# Altium project Callisto Control Board.PrjPcb
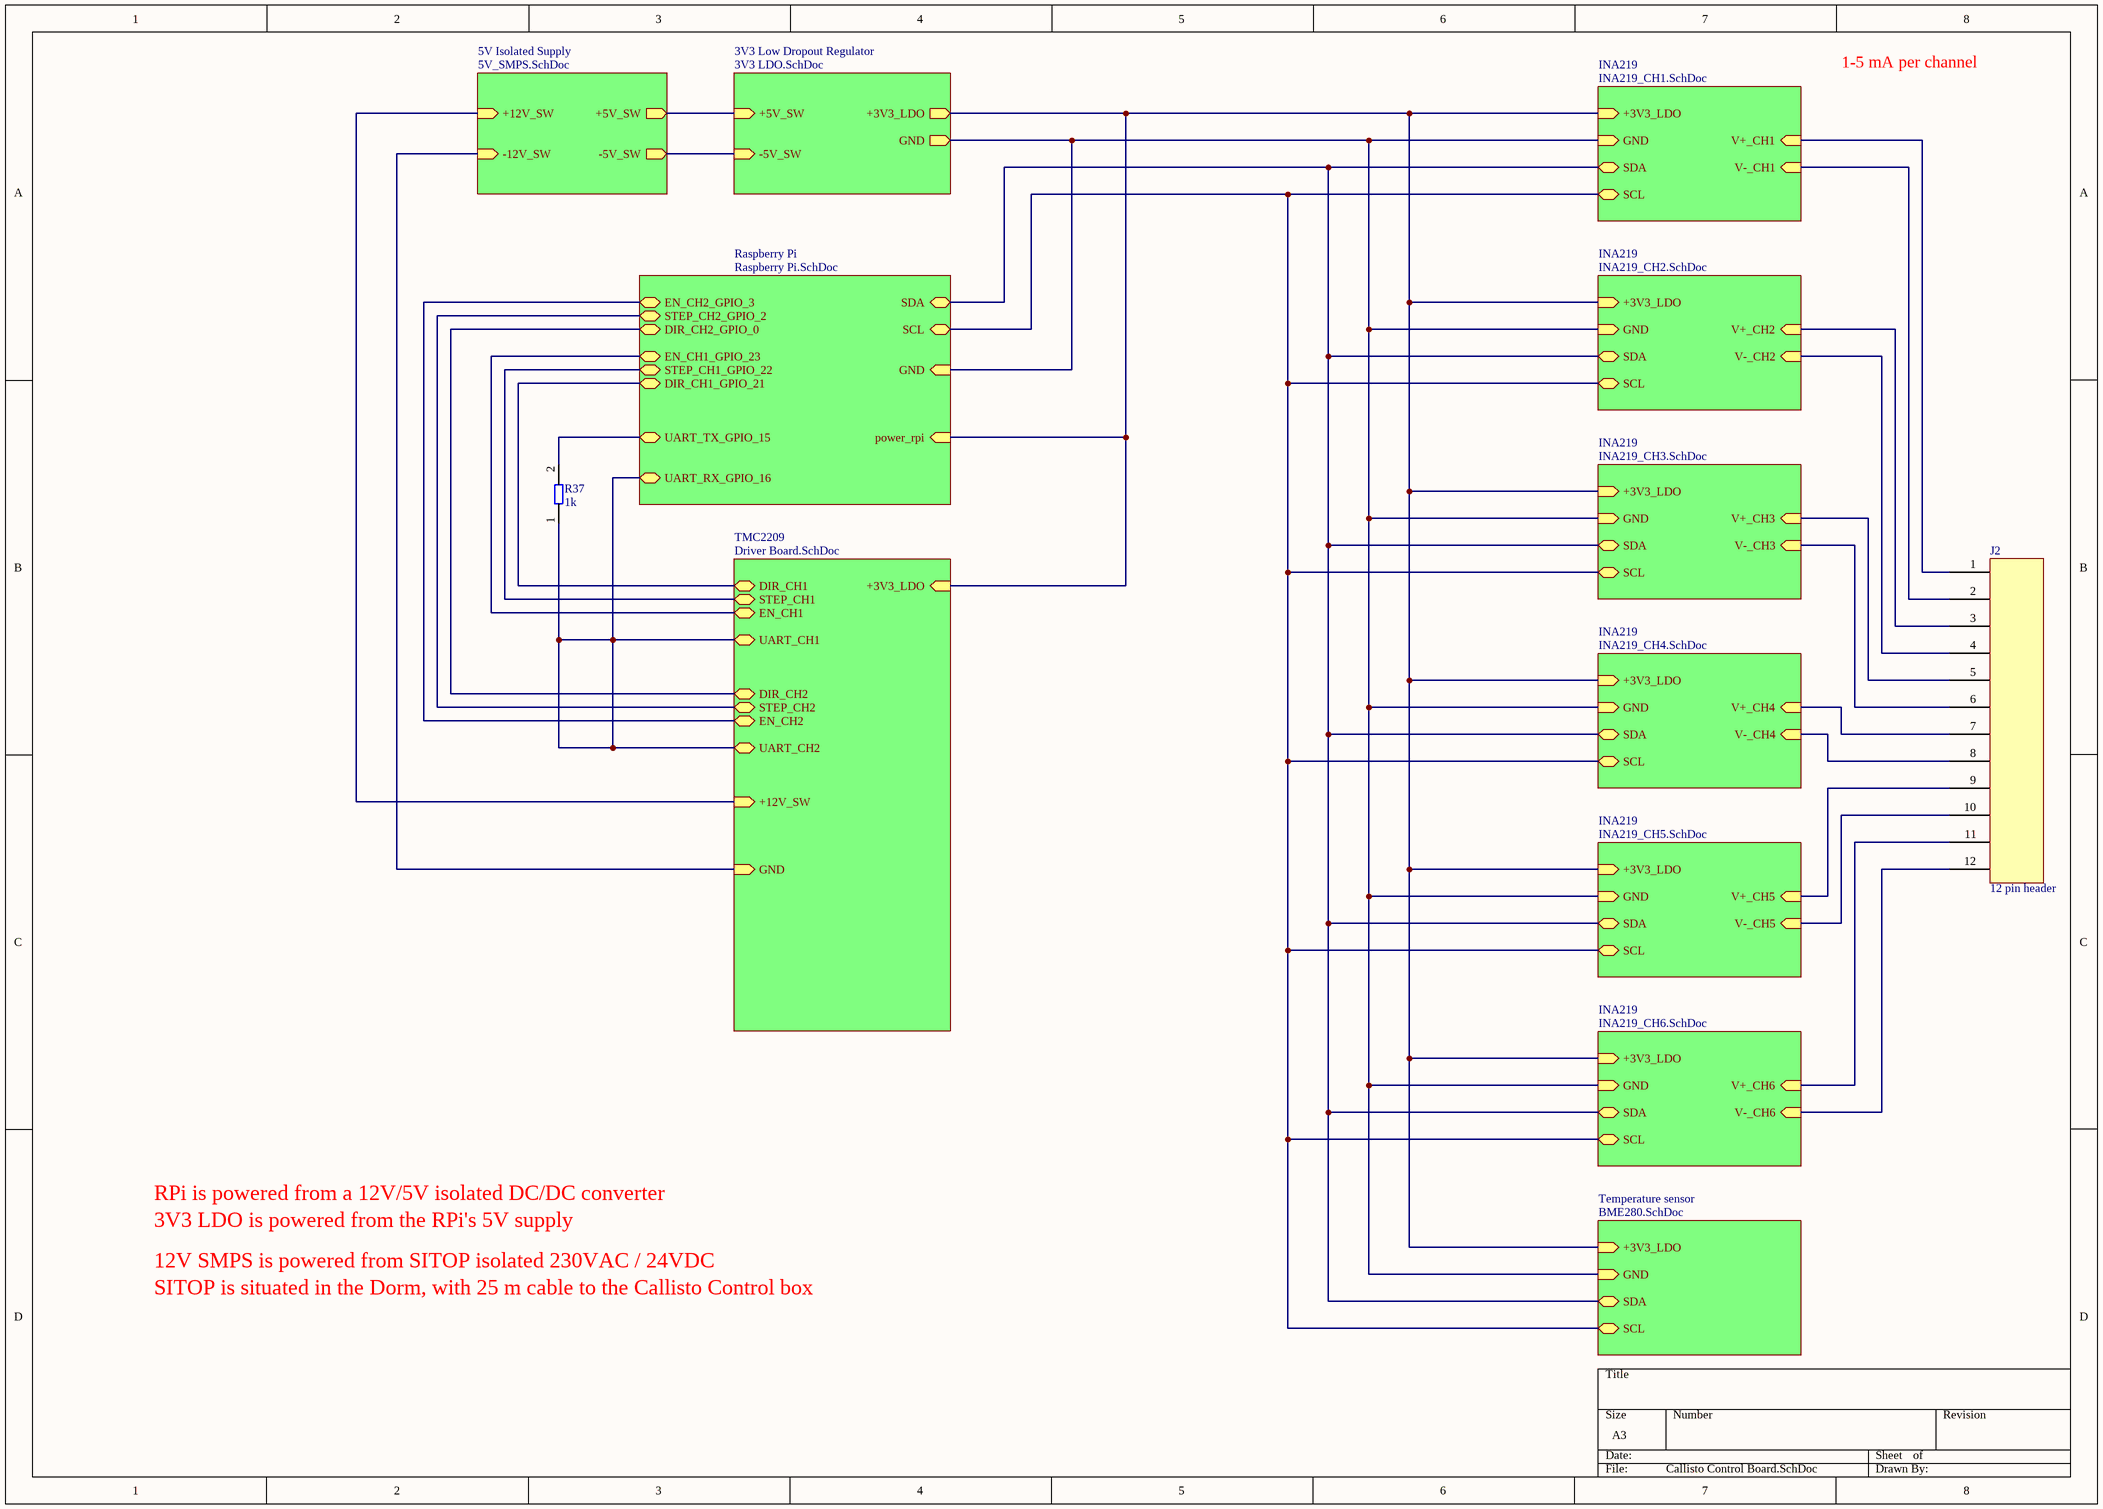
[diagram p0: Callisto Control Board.SchDoc]
11 sheets, 77 parts. Net scope: hierarchical (ports join the sheet entries above them; power ports are global).
Board file: Callisto Control Board.PcbDoc
Sheets:
  Callisto Control Board.SchDoc
    INA219 = INA219_CH1.SchDoc
    3V3 Low Dropout Regulator = 3V3 LDO.SchDoc
    INA219 = INA219_CH2.SchDoc
    INA219 = INA219_CH3.SchDoc
    INA219 = INA219_CH4.SchDoc
    INA219 = INA219_CH5.SchDoc
    INA219 = INA219_CH6.SchDoc
    Raspberry Pi = Raspberry Pi.SchDoc
    Temperature sensor = BME280.SchDoc
    TMC2209 = Driver Board.SchDoc

## Sheet Callisto Control Board.SchDoc
size A3; SheetNumber: 1; SheetTotal: 12

### Parts
(Parts that share a designator on the sheet are numbered #1, #2 ... from top to bottom, then left to right.)
J2#1  12 pin header  [12 pin terminal]
R37  1k  [0805 Resistor - IPC A]

### Sub-sheets
3V3 Low Dropout Regulator = 3V3 LDO.SchDoc: +3V3_LDO (out), GND (out), +5V_SW (in), -5V_SW (in)
5V Isolated Supply = 5V_SMPS.SchDoc (file not in this document): +12V_SW (in), -12V_SW (in), +5V_SW (out), -5V_SW (out)
INA219 = INA219_CH1.SchDoc: SDA (bidir), SCL (bidir), +3V3_LDO (in), GND (in), V+_CH1 (in), V-_CH1 (in)
INA219 = INA219_CH2.SchDoc: SDA (bidir), SCL (bidir), +3V3_LDO (in), GND (in), V+_CH2 (in), V-_CH2 (in)
INA219 = INA219_CH3.SchDoc: SDA (bidir), SCL (bidir), +3V3_LDO (in), GND (in), V+_CH3 (in), V-_CH3 (in)
INA219 = INA219_CH4.SchDoc: SDA (bidir), SCL (bidir), +3V3_LDO (in), GND (in), V+_CH4 (in), V-_CH4 (in)
INA219 = INA219_CH5.SchDoc: SDA (bidir), SCL (bidir), +3V3_LDO (in), GND (in), V+_CH5 (in), V-_CH5 (in)
INA219 = INA219_CH6.SchDoc: SDA (bidir), SCL (bidir), +3V3_LDO (in), GND (in), V+_CH6 (in), V-_CH6 (in)
Raspberry Pi = Raspberry Pi.SchDoc: SDA (bidir), SCL (bidir), GND (in), UART_TX_GPIO_15 (bidir), UART_RX_GPIO_16 (bidir), STEP_CH2_GPIO_2 (bidir), EN_CH2_GPIO_3 (bidir), DIR_CH1_GPIO_21 (bidir), STEP_CH1_GPIO_22 (bidir), EN_CH1_GPIO_23 (bidir), DIR_CH2_GPIO_0 (bidir), power_rpi (in)
Temperature sensor = BME280.SchDoc: GND (in), +3V3_LDO (in), SCL (bidir), SDA (bidir)
TMC2209 = Driver Board.SchDoc: +3V3_LDO (in), DIR_CH2 (bidir), STEP_CH2 (bidir), EN_CH2 (bidir), DIR_CH1 (bidir), STEP_CH1 (bidir), EN_CH1 (bidir), +12V_SW (in), GND (in), UART_CH2 (bidir), UART_CH1 (bidir)

### Nets
+3V3_LDO: sheet INA219/+3V3_LDO, sheet 3V3 Low Dropout Regulator/+3V3_LDO, sheet INA219/+3V3_LDO, sheet INA219/+3V3_LDO, sheet INA219/+3V3_LDO, sheet INA219/+3V3_LDO, sheet INA219/+3V3_LDO, sheet Raspberry Pi/power_rpi, sheet Temperature sensor/+3V3_LDO, sheet TMC2209/+3V3_LDO
+12V_SW: sheet TMC2209/+12V_SW, sheet 5V Isolated Supply/+12V_SW
GND: sheet INA219/GND, sheet 3V3 Low Dropout Regulator/GND, sheet 3V3 Low Dropout Regulator/-5V_SW, sheet INA219/GND, sheet INA219/GND, sheet INA219/GND, sheet INA219/GND, sheet INA219/GND, sheet Raspberry Pi/GND, sheet Temperature sensor/GND, sheet TMC2209/GND, sheet 5V Isolated Supply/-12V_SW, sheet 5V Isolated Supply/-5V_SW
GPIO_0: sheet Raspberry Pi/DIR_CH2_GPIO_0, sheet TMC2209/DIR_CH2
GPIO_2: sheet Raspberry Pi/STEP_CH2_GPIO_2, sheet TMC2209/STEP_CH2
GPIO_3: sheet Raspberry Pi/EN_CH2_GPIO_3, sheet TMC2209/EN_CH2
GPIO_21: sheet Raspberry Pi/DIR_CH1_GPIO_21, sheet TMC2209/DIR_CH1
GPIO_22: sheet Raspberry Pi/STEP_CH1_GPIO_22, sheet TMC2209/STEP_CH1
GPIO_23: sheet Raspberry Pi/EN_CH1_GPIO_23, sheet TMC2209/EN_CH1
SCL: sheet INA219/SCL, sheet INA219/SCL, sheet INA219/SCL, sheet INA219/SCL, sheet INA219/SCL, sheet INA219/SCL, sheet Raspberry Pi/SCL, sheet Temperature sensor/SCL
SDA: sheet INA219/SDA, sheet INA219/SDA, sheet INA219/SDA, sheet INA219/SDA, sheet INA219/SDA, sheet INA219/SDA, sheet Raspberry Pi/SDA, sheet Temperature sensor/SDA
NetC7_1: sheet 3V3 Low Dropout Regulator/+5V_SW, sheet 5V Isolated Supply/+5V_SW
NetJ2#1_1: J2#1.1 ; sheet INA219/V+_CH1
NetJ2#1_2: J2#1.2 ; sheet INA219/V-_CH1
NetJ2#1_3: J2#1.3 ; sheet INA219/V+_CH2
NetJ2#1_4: J2#1.4 ; sheet INA219/V-_CH2
NetJ2#1_5: J2#1.5 ; sheet INA219/V+_CH3
NetJ2#1_6: J2#1.6 ; sheet INA219/V-_CH3
NetJ2#1_7: J2#1.7 ; sheet INA219/V+_CH4
NetJ2#1_8: J2#1.8 ; sheet INA219/V-_CH4
NetJ2#1_9: J2#1.9 ; sheet INA219/V+_CH5
NetJ2#1_10: J2#1.10 ; sheet INA219/V-_CH5
NetJ2#1_11: J2#1.11 ; sheet INA219/V+_CH6
NetJ2#1_12: J2#1.12 ; sheet INA219/V-_CH6
NetR35_2: R37.2 ; sheet Raspberry Pi/UART_TX_GPIO_15
NetR36_2: R37.1 ; sheet Raspberry Pi/UART_RX_GPIO_16, sheet TMC2209/UART_CH2, sheet TMC2209/UART_CH1

### Notes on the sheet
- 1-5 mA per channel
- RPi is powered from a 12V/5V isolated DC/DC converter
- 3V3 LDO is powered from the RPi's 5V supply
- 12V SMPS is powered from SITOP isolated 230VAC / 24VDC
- SITOP is situated in the Dorm, with 25 m cable to the Callisto Control box

### Library data of the parts
J2#1 = 12 pin terminal
R37 = RC0805FR-071KL: Thick Film Resistors - SMD 1 kOhms 125 mW 0805 1% / RC0805FR-071KL; Value: 1k; Part Number: RC0805FR-071KL

## Sheet INA219_CH1.SchDoc
size A4; SheetNumber: 4; SheetTotal: 11
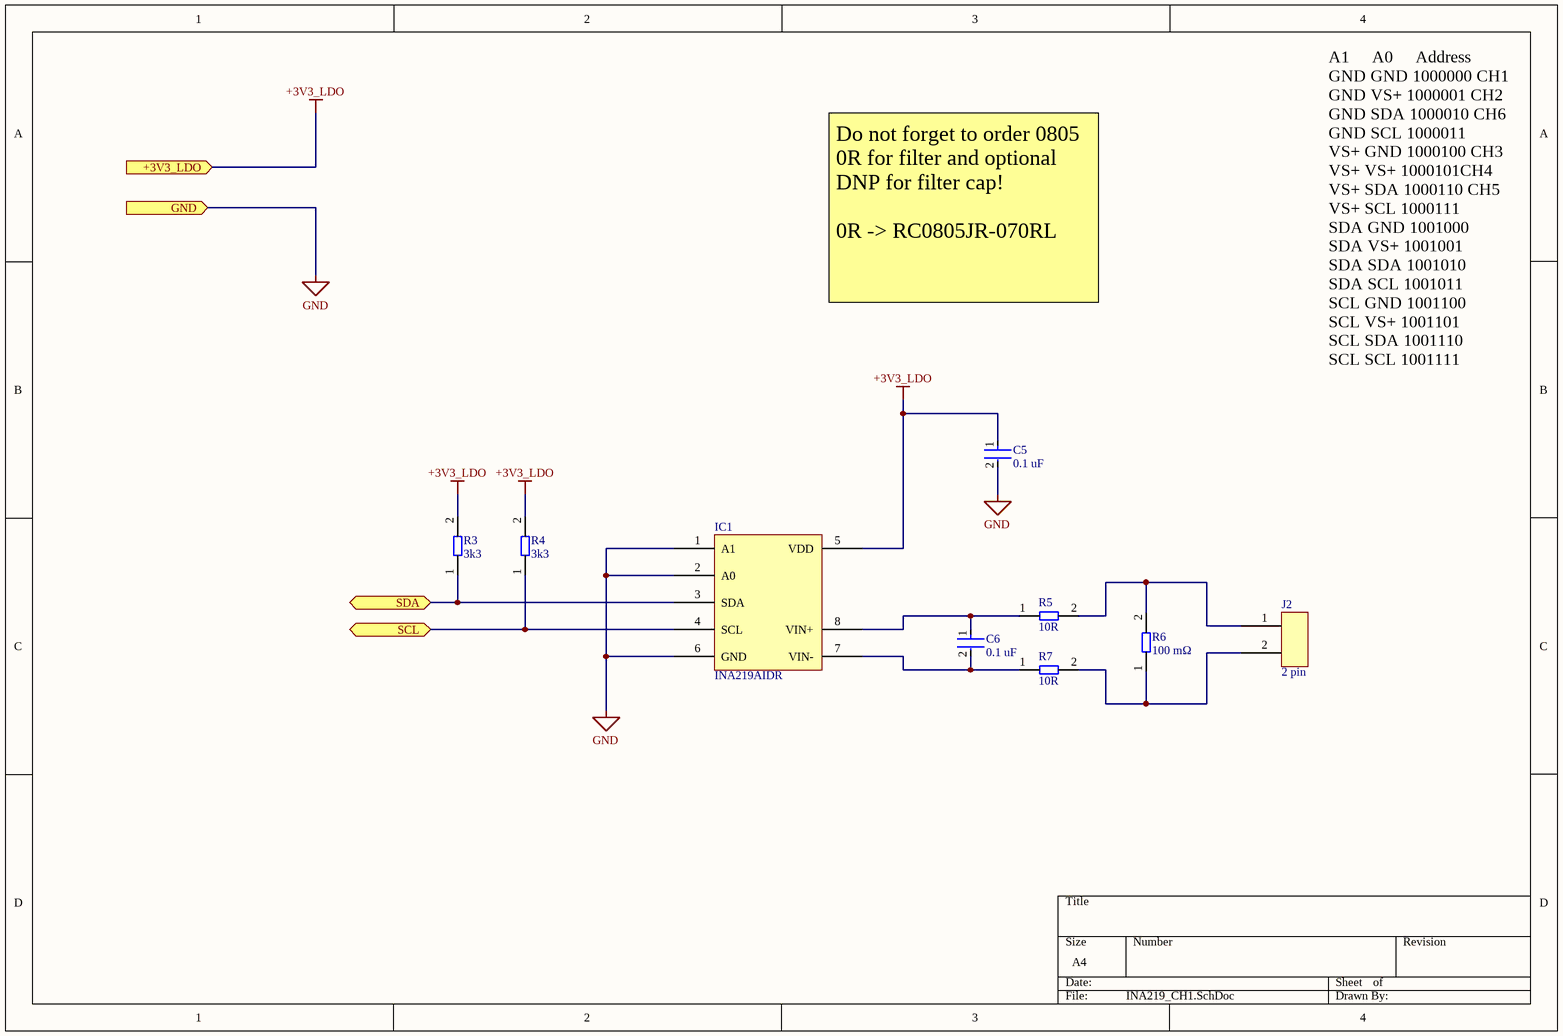
[diagram p1: INA219_CH1.SchDoc]

### Parts
(Parts that share a designator on the sheet are numbered #1, #2 ... from top to bottom, then left to right.)
C5  0.1 uF  [FP-C0805C-DN-MFG]
C6  0.1 uF  [FP-C0805C-DN-MFG]
IC1  INA219AIDR  [INA219AIDR]
J2#2  2 pin  [TB003-500-P02BE]
R3  3k3  [0805 Resistor - IPC A]
R4  3k3  [0805 Resistor - IPC A]
R5  10R  [0805 Resistor - IPC A]
R6  100 mΩ  [PE2512FKM070R1L]
R7  10R  [0805 Resistor - IPC A]

### Ports
+3V3_LDO (in, see Callisto Control Board[5A], 3V3 LDO[3B], BME280[2B], INA219_CH2[1B], INA219_CH3[1B], INA219_CH4[1B], INA219_CH5[1B], INA219_CH6[1B]), GND (in, see Callisto Control Board[5A], 3V3 LDO[3B], BME280[3B], INA219_CH2[1B], INA219_CH3[1B], INA219_CH4[1B], INA219_CH5[1B], INA219_CH6[1B], Raspberry Pi[1B]), SCL (bidir, see Callisto Control Board[6A], BME280[3B], INA219_CH2[1C], INA219_CH3[1C], INA219_CH4[1C], INA219_CH5[1C], INA219_CH6[1C], Raspberry Pi[1B]), SDA (bidir, see Callisto Control Board[6A], BME280[3B], INA219_CH2[1C], INA219_CH3[1C], INA219_CH4[1C], INA219_CH5[1C], INA219_CH6[1C], Raspberry Pi[1A])

### Nets
+3V3_LDO: C5.1 IC1.5(VDD) R3.2 R4.2 ; port +3V3_LDO
GND: C5.2 IC1.1(A1) IC1.2(A0) IC1.6(GND) ; port GND
SCL: IC1.4(SCL) R4.1 ; port SCL
SDA: IC1.3(SDA) R3.1 ; port SDA
NetC6_1: C6.1 IC1.8(VIN+) R5.1
NetC6_2: C6.2 IC1.7(VIN-) R7.1
NetJ2#2_1: J2#2.1 R5.2 R6.2
NetJ2#2_2: J2#2.2 R6.1 R7.2

### Notes on the sheet
- Do not forget to order 0805 0R for filter and optional DNP for filter cap!
  0R -> RC0805JR-070RL
- A1     A0     Address
  GND GND 1000000 CH1
  GND VS+ 1000001 CH2
  GND SDA 1000010 CH6
  GND SCL 1000011
  VS+ GND 1000100 CH3
  VS+ VS+ 1000101CH4
  VS+ SDA 1000110 CH5
  VS+ SCL 1000111
  SDA GND 1001000
  SDA VS+ 1001001
  SDA SDA 1001010
  SDA SCL 1001011
  SCL GND 1001100
  SCL VS+ 1001101
  SCL SDA 1001110
  SCL SCL 1001111

### Library data of the parts
C5 C6 = CMP-03020-002581-2: C0805 0.10 μF X7R 30ppm/°C 20.00% 50 V C0805C104M5RAC; Manufacturer: KEMET; Capacitance: 0.10 μF; Voltage Rating: 50 V; Value: 0.10 μF; Tolerance: 0.2; Material: Ceramic; Category: Cap; Temperature: -55°C to +125°C; Lead Free: Yes; Device Class L3: Ceramic Capacitors; Package: C0805C-DN; Height: 0.88mm; Temperature Range High: +125°C; Device Class L2: Capacitors; Manufacturer Part Number: C0805C104M5RAC; Device Class L1: Passive Components; Temperature Coefficient: 30ppm/°C; ComponentLink2Description: Datasheet; RoHS: TRUE; Temperature Range Low: -55°C; ComponentLink2URL: https://content.kemet.com/datasheets/KEM_C1003_C0G_SMD.pdf; Temperature Characteristic: X7R; Mouser Description: Multilayer Ceramic Capacitors MLCC - SMD/SMT 50volts 0.1uF 20% X7R; Octopart: https://octopart.com/c0805c104m5rac-kemet-2226142; Ipc Land Pattern Name: CAPC200125X78; Automotive: No
IC1 = INA219AIDR: Current & Power Monitors & Regulators Zero-Drift,Bi-Dir Crnt/Pwr Monitor
J2#2 = TB003-500-P02BE: Fixed Terminal Blocks Terminal block, screw type, 5.00 , horizontal, 2 poles, CUI Blue, Philip's head screw, PCB mount; Value: 2 pin
R3 R4 = RE0805FRE073K3L: Thick Film Resistors - SMD 3.3 kOhms 125 mW 0805 1% / RE0805FRE073K3L
R5 R7 = RC0805FR-0710RL: Thick Film Resistors - SMD 10 Ohms 125 mW 0805 1% / RC0805FR-0710RL
R6 = PE2512FKM070R1L: Current Sense Resistors - SMD 100 mOhms 1 Watt 1 % 75 ppm/C AEC-Q200 / PE2512FKM070R1L

## Sheet 3V3 LDO.SchDoc
size A4; SheetNumber: 3; SheetTotal: 11
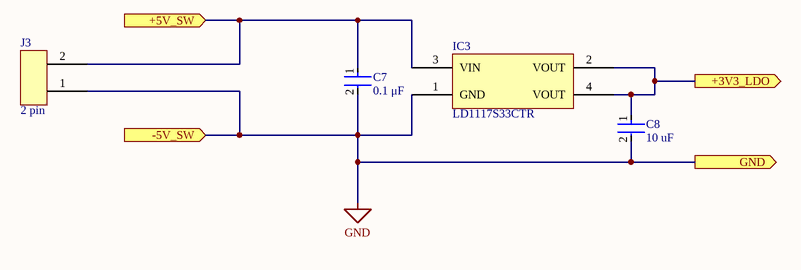
[diagram p2: 3V3 LDO.SchDoc]

### Parts
C7  0.1 μF  [FP-C0805C-DN-MFG]
C8  10 uF  [FP-C0805C-DG-MFG]
IC3  LD1117S33CTR  [LD1117]
J3  2 pin  [TB003-500-P02BE]

### Ports
+3V3_LDO (out, see Callisto Control Board[5A], BME280[2B], INA219_CH1[1A], INA219_CH2[1B], INA219_CH3[1B], INA219_CH4[1B], INA219_CH5[1B], INA219_CH6[1B]), +5V_SW (in, see Callisto Control Board[4A]), -5V_SW (in, see Callisto Control Board[4A]), GND (out, see Callisto Control Board[5A], BME280[3B], INA219_CH1[1A], INA219_CH2[1B], INA219_CH3[1B], INA219_CH4[1B], INA219_CH5[1B], INA219_CH6[1B], Raspberry Pi[1B])

### Nets
+3V3_LDO: C8.1 IC3.2(VOUT) IC3.4(VOUT) ; port +3V3_LDO
GND: C7.2 C8.2 IC3.1(GND) J3.1 ; port -5V_SW, port GND
NetC7_1: C7.1 IC3.3(VIN) J3.2 ; port +5V_SW

### Library data of the parts
C7 = CMP-03020-002581-2: C0805 0.10 μF X7R 30ppm/°C 20.00% 50 V C0805C104M5RAC; Manufacturer: KEMET; Voltage Rating: 50 V; Tolerance: 0.2; Material: Ceramic; Category: Cap; Temperature: -55°C to +125°C; Lead Free: Yes; Device Class L3: Ceramic Capacitors; Package: C0805C-DN; Capacitance: 0.1 μF; Height: 0.88mm; Temperature Range High: +125°C; Device Class L2: Capacitors; Manufacturer Part Number: C0805C104M5RAC; Device Class L1: Passive Components; Temperature Coefficient: 30ppm/°C; ComponentLink2Description: Datasheet; RoHS: TRUE; Temperature Range Low: -55°C; Value: 0.1 μF; ComponentLink2URL: https://content.kemet.com/datasheets/KEM_C1003_C0G_SMD.pdf; Temperature Characteristic: X7R; Mouser Description: Multilayer Ceramic Capacitors MLCC - SMD/SMT 50volts 0.1uF 20% X7R; Octopart: https://octopart.com/c0805c104m5rac-kemet-2226142; Ipc Land Pattern Name: CAPC200125X78; Automotive: No
C8 = CMP-2007-03243-2: CAP CER 10UF 10V X5R 0805 / C0805C106K8PACTU; Manufacturer: Kemet; 3DS Part Number: 220-00001; Tolerance: 10%; Temperature Coefficient: 15%; Material: Ceramic; Device Class L2: Capacitors; Device Class L1: Passive Components; ComponentLink2URL: https://content.kemet.com/datasheets/KEM_C1006_X5R_SMD.pdf; Height: 1.4mm; Lead Free: Yes; Manufacturer Part Number: C0805C106K8PACTU; Digikey Description: CAP CER 10UF 10V X5R 0805; Octopart: https://octopart.com/c0805c106k8pactu-kemet-98697; Capacitance: 10 uF; Value: 10 uF; Temperature Range Low: -55°C; Temperature: -55°C to +85°C; Automotive: No; Mouser Description: CAP CER 10UF 10V X5R 0805; Ipc Land Pattern Name: CAPC200125X125; Temperature Range High: +85°C; Voltage: 10V; RoHS: TRUE; Device Class L3: Ceramic Capacitors; ComponentLink2Description: Datasheet; Voltage Rating: 10V; Package: C0805C-DG; Temperature Characteristic: X5R; Category: Cap
IC3 = LD1117S33CTR: IC REG LINEAR 3.3V 800MA SOT223
J3 = TB003-500-P02BE: as J2#2 on sheet INA219_CH1; Value: 2 pin

## Sheet INA219_CH2.SchDoc
size A4; SheetNumber: 5; SheetTotal: 11
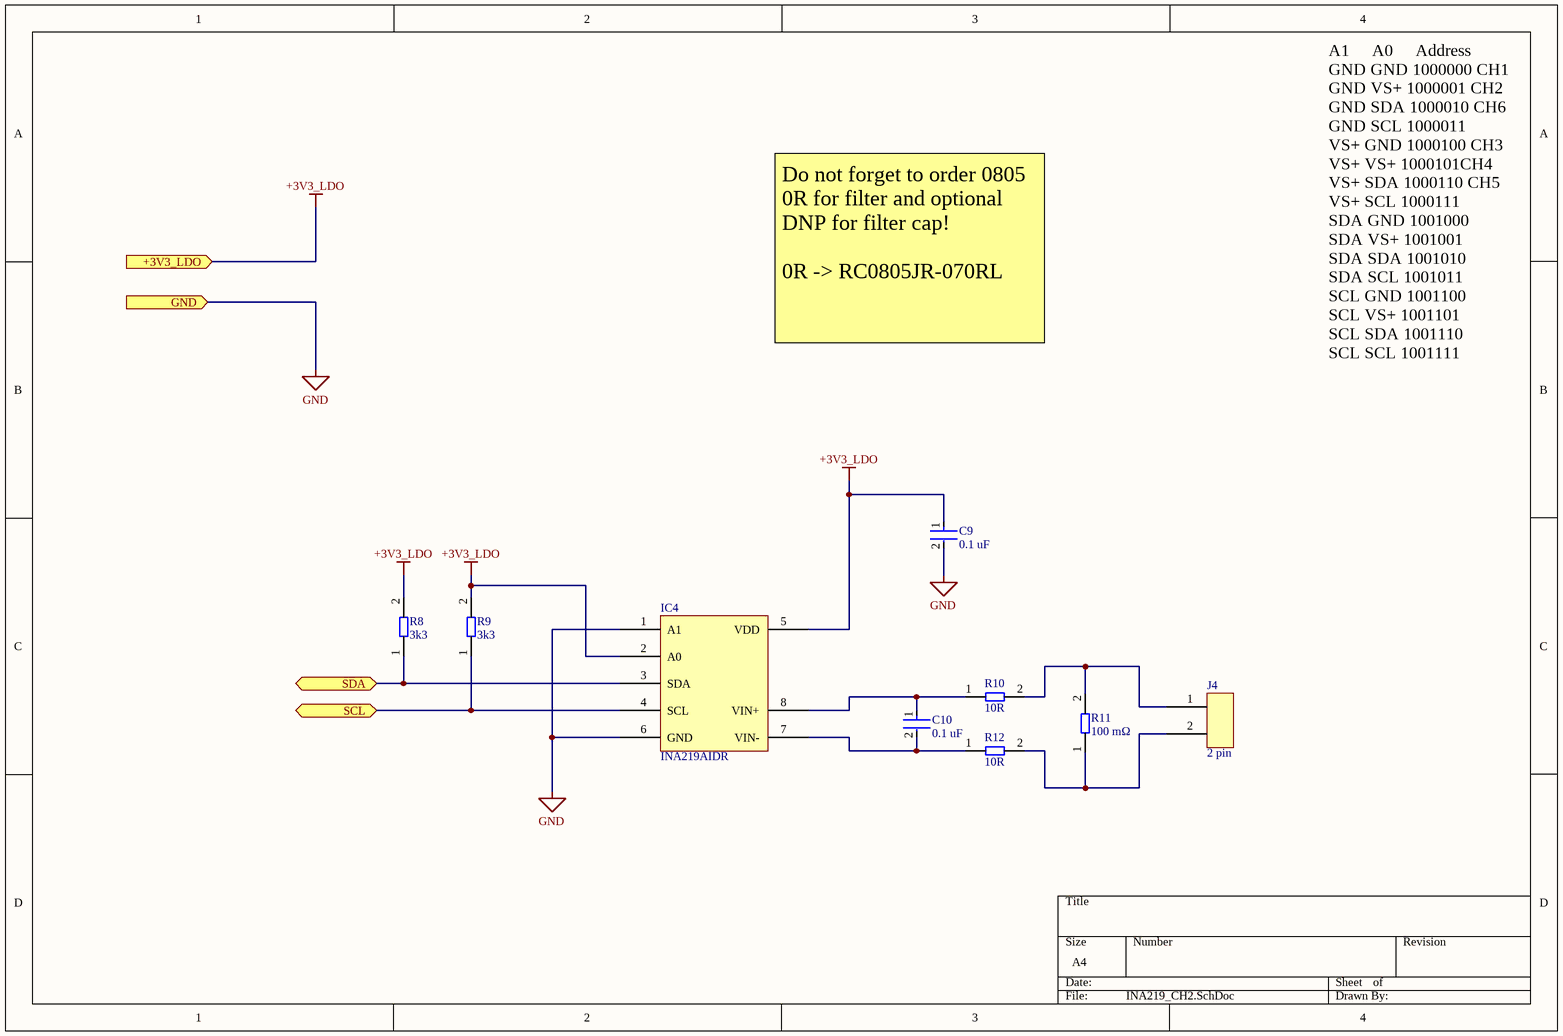
[diagram p3: INA219_CH2.SchDoc]

### Parts
(Parts that share a designator on the sheet are numbered #1, #2 ... from top to bottom, then left to right.)
C9  0.1 uF  [FP-C0805C-DN-MFG]
C10  0.1 uF  [FP-C0805C-DN-MFG]
IC4  INA219AIDR  [INA219AIDR]
J4#1  2 pin  [TB003-500-P02BE]
R8  3k3  [0805 Resistor - IPC A]
R9  3k3  [0805 Resistor - IPC A]
R10  10R  [0805 Resistor - IPC A]
R11  100 mΩ  [PE2512FKM070R1L]
R12  10R  [0805 Resistor - IPC A]

### Ports
+3V3_LDO (in, see Callisto Control Board[5B], 3V3 LDO[3B], BME280[2B], INA219_CH1[1A], INA219_CH3[1B], INA219_CH4[1B], INA219_CH5[1B], INA219_CH6[1B]), GND (in, see Callisto Control Board[5B], 3V3 LDO[3B], BME280[3B], INA219_CH1[1A], INA219_CH3[1B], INA219_CH4[1B], INA219_CH5[1B], INA219_CH6[1B], Raspberry Pi[1B]), SCL (bidir, see Callisto Control Board[6B], BME280[3B], INA219_CH1[1C], INA219_CH3[1C], INA219_CH4[1C], INA219_CH5[1C], INA219_CH6[1C], Raspberry Pi[1B]), SDA (bidir, see Callisto Control Board[6B], BME280[3B], INA219_CH1[1C], INA219_CH3[1C], INA219_CH4[1C], INA219_CH5[1C], INA219_CH6[1C], Raspberry Pi[1A])

### Nets
+3V3_LDO: C9.1 IC4.2(A0) IC4.5(VDD) R8.2 R9.2 ; port +3V3_LDO
GND: C9.2 IC4.1(A1) IC4.6(GND) ; port GND
SCL: IC4.4(SCL) R9.1 ; port SCL
SDA: IC4.3(SDA) R8.1 ; port SDA
NetC10_1: C10.1 IC4.8(VIN+) R10.1
NetC10_2: C10.2 IC4.7(VIN-) R12.1
NetJ4#1_1: J4#1.1 R10.2 R11.2
NetJ4#1_2: J4#1.2 R11.1 R12.2

### Notes on the sheet
- Do not forget to order 0805 0R for filter and optional DNP for filter cap!
  0R -> RC0805JR-070RL
- A1     A0     Address
  GND GND 1000000 CH1
  GND VS+ 1000001 CH2
  GND SDA 1000010 CH6
  GND SCL 1000011
  VS+ GND 1000100 CH3
  VS+ VS+ 1000101CH4
  VS+ SDA 1000110 CH5
  VS+ SCL 1000111
  SDA GND 1001000
  SDA VS+ 1001001
  SDA SDA 1001010
  SDA SCL 1001011
  SCL GND 1001100
  SCL VS+ 1001101
  SCL SDA 1001110
  SCL SCL 1001111

### Library data of the parts
C9 C10 = CMP-03020-002581-2: as C5 on sheet INA219_CH1; Category: Cap; Temperature: -55°C to +125°C; Lead Free: Yes; Device Class L3: Ceramic Capacitors; Package: C0805C-DN; Height: 0.88mm; Temperature Range High: +125°C; Device Class L2: Capacitors; Manufacturer Part Number: C0805C104M5RAC; Device Class L1: Passive Components; Temperature Coefficient: 30ppm/°C; ComponentLink2Description: Datasheet; RoHS: TRUE; Temperature Range Low: -55°C; ComponentLink2URL: https://content.kemet.com/datasheets/KEM_C1003_C0G_SMD.pdf; Temperature Characteristic: X7R; Mouser Description: Multilayer Ceramic Capacitors MLCC - SMD/SMT 50volts 0.1uF 20% X7R; Octopart: https://octopart.com/c0805c104m5rac-kemet-2226142; Ipc Land Pattern Name: CAPC200125X78; Automotive: No
IC4 = INA219AIDR: as IC1 on sheet INA219_CH1
J4#1 = TB003-500-P02BE: as J2#2 on sheet INA219_CH1; Value: 2 pin
R8 R9 = RE0805FRE073K3L: as R3 on sheet INA219_CH1
R10 R12 = RC0805FR-0710RL: as R5 on sheet INA219_CH1
R11 = PE2512FKM070R1L: as R6 on sheet INA219_CH1

## Sheet INA219_CH3.SchDoc
size A4; SheetNumber: 6; SheetTotal: 13
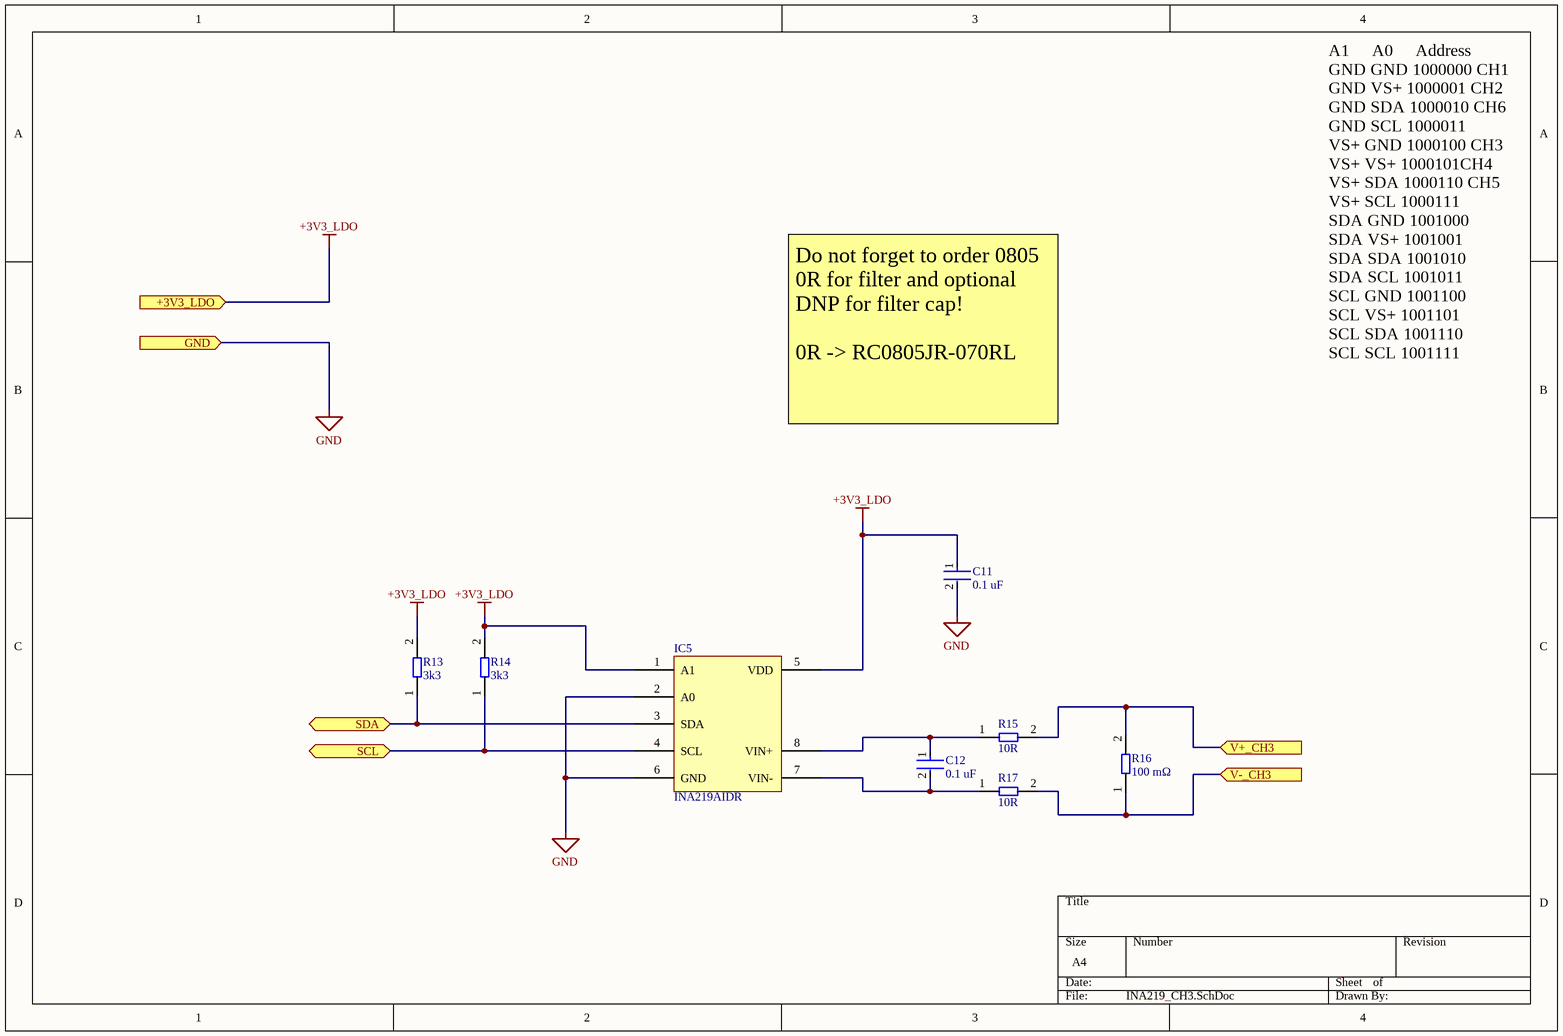
[diagram p4: INA219_CH3.SchDoc]

### Parts
C11  0.1 uF  [FP-C0805C-DN-MFG]
C12  0.1 uF  [FP-C0805C-DN-MFG]
IC5  INA219AIDR  [INA219AIDR]
R13  3k3  [0805 Resistor - IPC A]
R14  3k3  [0805 Resistor - IPC A]
R15  10R  [0805 Resistor - IPC A]
R16  100 mΩ  [PE2512FKM070R1L]
R17  10R  [0805 Resistor - IPC A]

### Ports
+3V3_LDO (in, see Callisto Control Board[7B], 3V3 LDO[3B], BME280[2B], Driver Board[1B], INA219_CH1[1A], INA219_CH2[1B], INA219_CH4[1B], INA219_CH5[1B], INA219_CH6[1B]), GND (in, see Callisto Control Board[7B], 3V3 LDO[3B], BME280[3B], Driver Board[1B], INA219_CH1[1A], INA219_CH2[1B], INA219_CH4[1B], INA219_CH5[1B], INA219_CH6[1B], Raspberry Pi[1C]), SCL (bidir, see Callisto Control Board[7B], BME280[3B], INA219_CH1[1C], INA219_CH2[1C], INA219_CH4[1C], INA219_CH5[1C], INA219_CH6[1C], Raspberry Pi[1B]), SDA (bidir, see Callisto Control Board[7B], BME280[3B], INA219_CH1[1C], INA219_CH2[1C], INA219_CH4[1C], INA219_CH5[1C], INA219_CH6[1C], Raspberry Pi[1A]), V+_CH3 (in), V-_CH3 (in)

### Nets
+3V3_LDO: C11.1 IC5.1(A1) IC5.5(VDD) R13.2 R14.2 ; port +3V3_LDO
GND: C11.2 IC5.2(A0) IC5.6(GND) ; port GND
SCL: IC5.4(SCL) R14.1 ; port SCL
SDA: IC5.3(SDA) R13.1 ; port SDA
NetC12_1: C12.1 IC5.8(VIN+) R15.1
NetC12_2: C12.2 IC5.7(VIN-) R17.1
NetJ2#1_5: R15.2 R16.2 ; port V+_CH3
NetJ2#1_6: R16.1 R17.2 ; port V-_CH3

### Notes on the sheet
- A1     A0     Address
  GND GND 1000000 CH1
  GND VS+ 1000001 CH2
  GND SDA 1000010 CH6
  GND SCL 1000011
  VS+ GND 1000100 CH3
  VS+ VS+ 1000101CH4
  VS+ SDA 1000110 CH5
  VS+ SCL 1000111
  SDA GND 1001000
  SDA VS+ 1001001
  SDA SDA 1001010
  SDA SCL 1001011
  SCL GND 1001100
  SCL VS+ 1001101
  SCL SDA 1001110
  SCL SCL 1001111
- Do not forget to order 0805 0R for filter and optional DNP for filter cap!
  0R -> RC0805JR-070RL

### Library data of the parts
C11 C12 = CMP-03020-002581-2: as C5 on sheet INA219_CH1; Category: Cap; Temperature: -55°C to +125°C; Lead Free: Yes; Device Class L3: Ceramic Capacitors; Package: C0805C-DN; Height: 0.88mm; Temperature Range High: +125°C; Device Class L2: Capacitors; Manufacturer Part Number: C0805C104M5RAC; Device Class L1: Passive Components; Temperature Coefficient: 30ppm/°C; ComponentLink2Description: Datasheet; RoHS: TRUE; Temperature Range Low: -55°C; ComponentLink2URL: https://content.kemet.com/datasheets/KEM_C1003_C0G_SMD.pdf; Temperature Characteristic: X7R; Mouser Description: Multilayer Ceramic Capacitors MLCC - SMD/SMT 50volts 0.1uF 20% X7R; Octopart: https://octopart.com/c0805c104m5rac-kemet-2226142; Ipc Land Pattern Name: CAPC200125X78; Automotive: No
IC5 = INA219AIDR: as IC1 on sheet INA219_CH1
R13 R14 = RE0805FRE073K3L: as R3 on sheet INA219_CH1
R15 R17 = RC0805FR-0710RL: as R5 on sheet INA219_CH1
R16 = PE2512FKM070R1L: as R6 on sheet INA219_CH1

## Sheet INA219_CH4.SchDoc
size A4; SheetNumber: 7; SheetTotal: 13
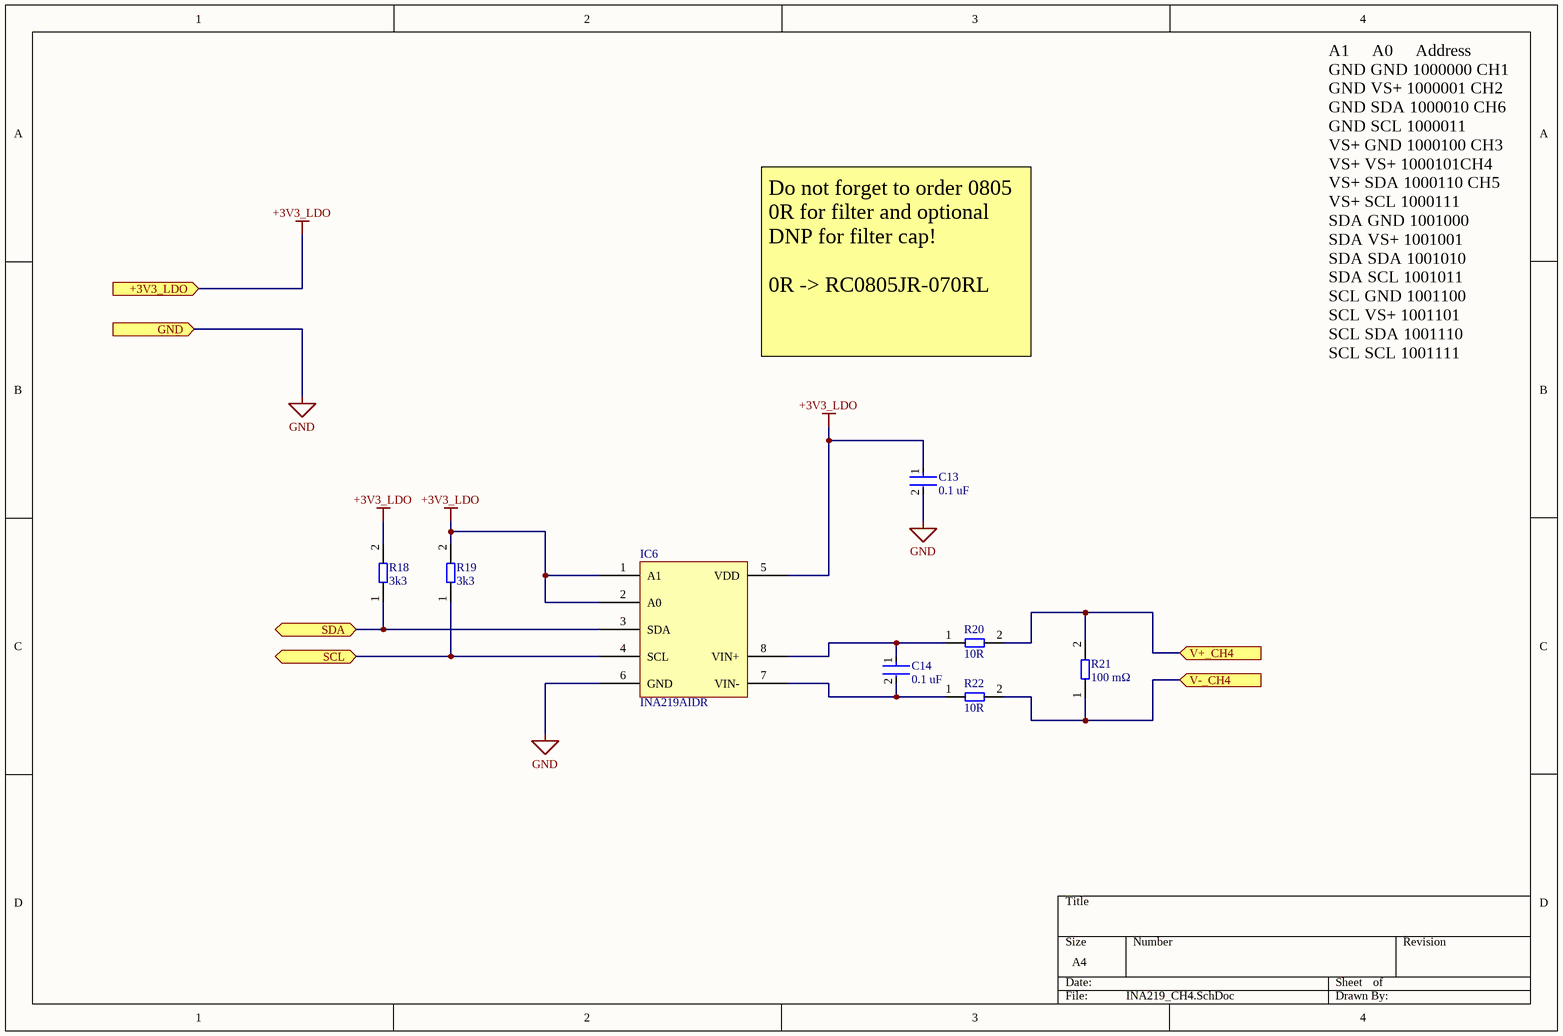
[diagram p5: INA219_CH4.SchDoc]

### Parts
C13  0.1 uF  [FP-C0805C-DN-MFG]
C14  0.1 uF  [FP-C0805C-DN-MFG]
IC6  INA219AIDR  [INA219AIDR]
R18  3k3  [0805 Resistor - IPC A]
R19  3k3  [0805 Resistor - IPC A]
R20  10R  [0805 Resistor - IPC A]
R21  100 mΩ  [PE2512FKM070R1L]
R22  10R  [0805 Resistor - IPC A]

### Ports
+3V3_LDO (in, see Callisto Control Board[7B], 3V3 LDO[3B], BME280[2B], Driver Board[1B], INA219_CH1[1A], INA219_CH2[1B], INA219_CH3[1B], INA219_CH5[1B], INA219_CH6[1B]), GND (in, see Callisto Control Board[7B], 3V3 LDO[3B], BME280[3B], Driver Board[1B], INA219_CH1[1A], INA219_CH2[1B], INA219_CH3[1B], INA219_CH5[1B], INA219_CH6[1B], Raspberry Pi[1C]), SCL (bidir, see Callisto Control Board[7C], BME280[3B], INA219_CH1[1C], INA219_CH2[1C], INA219_CH3[1C], INA219_CH5[1C], INA219_CH6[1C], Raspberry Pi[1B]), SDA (bidir, see Callisto Control Board[7B], BME280[3B], INA219_CH1[1C], INA219_CH2[1C], INA219_CH3[1C], INA219_CH5[1C], INA219_CH6[1C], Raspberry Pi[1A]), V+_CH4 (in), V-_CH4 (in)

### Nets
+3V3_LDO: C13.1 IC6.1(A1) IC6.2(A0) IC6.5(VDD) R18.2 R19.2 ; port +3V3_LDO
GND: C13.2 IC6.6(GND) ; port GND
SCL: IC6.4(SCL) R19.1 ; port SCL
SDA: IC6.3(SDA) R18.1 ; port SDA
NetC14_1: C14.1 IC6.8(VIN+) R20.1
NetC14_2: C14.2 IC6.7(VIN-) R22.1
NetJ2#1_7: R20.2 R21.2 ; port V+_CH4
NetJ2#1_8: R21.1 R22.2 ; port V-_CH4

### Notes on the sheet
- Do not forget to order 0805 0R for filter and optional DNP for filter cap!
  0R -> RC0805JR-070RL
- A1     A0     Address
  GND GND 1000000 CH1
  GND VS+ 1000001 CH2
  GND SDA 1000010 CH6
  GND SCL 1000011
  VS+ GND 1000100 CH3
  VS+ VS+ 1000101CH4
  VS+ SDA 1000110 CH5
  VS+ SCL 1000111
  SDA GND 1001000
  SDA VS+ 1001001
  SDA SDA 1001010
  SDA SCL 1001011
  SCL GND 1001100
  SCL VS+ 1001101
  SCL SDA 1001110
  SCL SCL 1001111

### Library data of the parts
C13 C14 = CMP-03020-002581-2: as C5 on sheet INA219_CH1; Category: Cap; Temperature: -55°C to +125°C; Lead Free: Yes; Device Class L3: Ceramic Capacitors; Package: C0805C-DN; Height: 0.88mm; Temperature Range High: +125°C; Device Class L2: Capacitors; Manufacturer Part Number: C0805C104M5RAC; Device Class L1: Passive Components; Temperature Coefficient: 30ppm/°C; ComponentLink2Description: Datasheet; RoHS: TRUE; Temperature Range Low: -55°C; ComponentLink2URL: https://content.kemet.com/datasheets/KEM_C1003_C0G_SMD.pdf; Temperature Characteristic: X7R; Mouser Description: Multilayer Ceramic Capacitors MLCC - SMD/SMT 50volts 0.1uF 20% X7R; Octopart: https://octopart.com/c0805c104m5rac-kemet-2226142; Ipc Land Pattern Name: CAPC200125X78; Automotive: No
IC6 = INA219AIDR: as IC1 on sheet INA219_CH1
R18 R19 = RE0805FRE073K3L: as R3 on sheet INA219_CH1
R20 R22 = RC0805FR-0710RL: as R5 on sheet INA219_CH1
R21 = PE2512FKM070R1L: as R6 on sheet INA219_CH1

## Sheet INA219_CH5.SchDoc
size A4; SheetNumber: 8; SheetTotal: 13
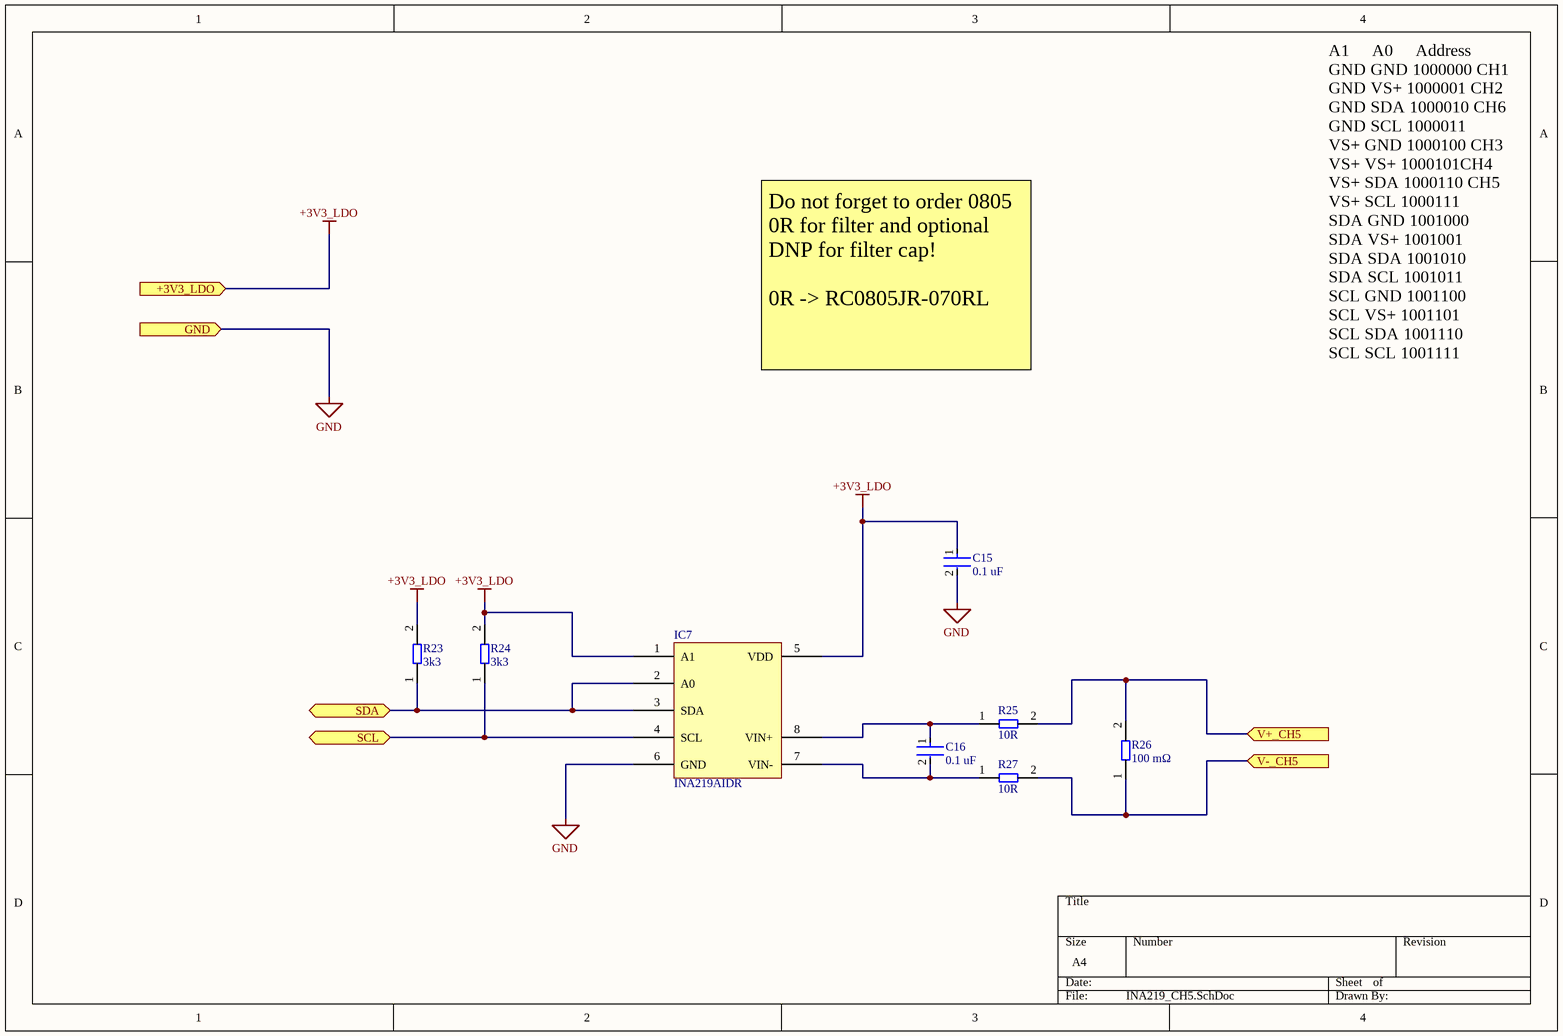
[diagram p6: INA219_CH5.SchDoc]

### Parts
C15  0.1 uF  [FP-C0805C-DN-MFG]
C16  0.1 uF  [FP-C0805C-DN-MFG]
IC7  INA219AIDR  [INA219AIDR]
R23  3k3  [0805 Resistor - IPC A]
R24  3k3  [0805 Resistor - IPC A]
R25  10R  [0805 Resistor - IPC A]
R26  100 mΩ  [PE2512FKM070R1L]
R27  10R  [0805 Resistor - IPC A]

### Ports
+3V3_LDO (in, see Callisto Control Board[7C], 3V3 LDO[3B], BME280[2B], Driver Board[1B], INA219_CH1[1A], INA219_CH2[1B], INA219_CH3[1B], INA219_CH4[1B], INA219_CH6[1B]), GND (in, see Callisto Control Board[7C], 3V3 LDO[3B], BME280[3B], Driver Board[1B], INA219_CH1[1A], INA219_CH2[1B], INA219_CH3[1B], INA219_CH4[1B], INA219_CH6[1B], Raspberry Pi[1C]), SCL (bidir, see Callisto Control Board[7C], BME280[3B], INA219_CH1[1C], INA219_CH2[1C], INA219_CH3[1C], INA219_CH4[1C], INA219_CH6[1C], Raspberry Pi[1B]), SDA (bidir, see Callisto Control Board[7C], BME280[3B], INA219_CH1[1C], INA219_CH2[1C], INA219_CH3[1C], INA219_CH4[1C], INA219_CH6[1C], Raspberry Pi[1A]), V+_CH5 (in), V-_CH5 (in)

### Nets
+3V3_LDO: C15.1 IC7.1(A1) IC7.5(VDD) R23.2 R24.2 ; port +3V3_LDO
GND: C15.2 IC7.6(GND) ; port GND
SCL: IC7.4(SCL) R24.1 ; port SCL
SDA: IC7.2(A0) IC7.3(SDA) R23.1 ; port SDA
NetC16_1: C16.1 IC7.8(VIN+) R25.1
NetC16_2: C16.2 IC7.7(VIN-) R27.1
NetJ2#1_9: R25.2 R26.2 ; port V+_CH5
NetJ2#1_10: R26.1 R27.2 ; port V-_CH5

### Notes on the sheet
- Do not forget to order 0805 0R for filter and optional DNP for filter cap!
  0R -> RC0805JR-070RL
- A1     A0     Address
  GND GND 1000000 CH1
  GND VS+ 1000001 CH2
  GND SDA 1000010 CH6
  GND SCL 1000011
  VS+ GND 1000100 CH3
  VS+ VS+ 1000101CH4
  VS+ SDA 1000110 CH5
  VS+ SCL 1000111
  SDA GND 1001000
  SDA VS+ 1001001
  SDA SDA 1001010
  SDA SCL 1001011
  SCL GND 1001100
  SCL VS+ 1001101
  SCL SDA 1001110
  SCL SCL 1001111

### Library data of the parts
C15 C16 = CMP-03020-002581-2: as C5 on sheet INA219_CH1; Category: Cap; Temperature: -55°C to +125°C; Lead Free: Yes; Device Class L3: Ceramic Capacitors; Package: C0805C-DN; Height: 0.88mm; Temperature Range High: +125°C; Device Class L2: Capacitors; Manufacturer Part Number: C0805C104M5RAC; Device Class L1: Passive Components; Temperature Coefficient: 30ppm/°C; ComponentLink2Description: Datasheet; RoHS: TRUE; Temperature Range Low: -55°C; ComponentLink2URL: https://content.kemet.com/datasheets/KEM_C1003_C0G_SMD.pdf; Temperature Characteristic: X7R; Mouser Description: Multilayer Ceramic Capacitors MLCC - SMD/SMT 50volts 0.1uF 20% X7R; Octopart: https://octopart.com/c0805c104m5rac-kemet-2226142; Ipc Land Pattern Name: CAPC200125X78; Automotive: No
IC7 = INA219AIDR: as IC1 on sheet INA219_CH1
R23 R24 = RE0805FRE073K3L: as R3 on sheet INA219_CH1
R25 R27 = RC0805FR-0710RL: as R5 on sheet INA219_CH1
R26 = PE2512FKM070R1L: as R6 on sheet INA219_CH1

## Sheet INA219_CH6.SchDoc
size A4; SheetNumber: 9; SheetTotal: 13
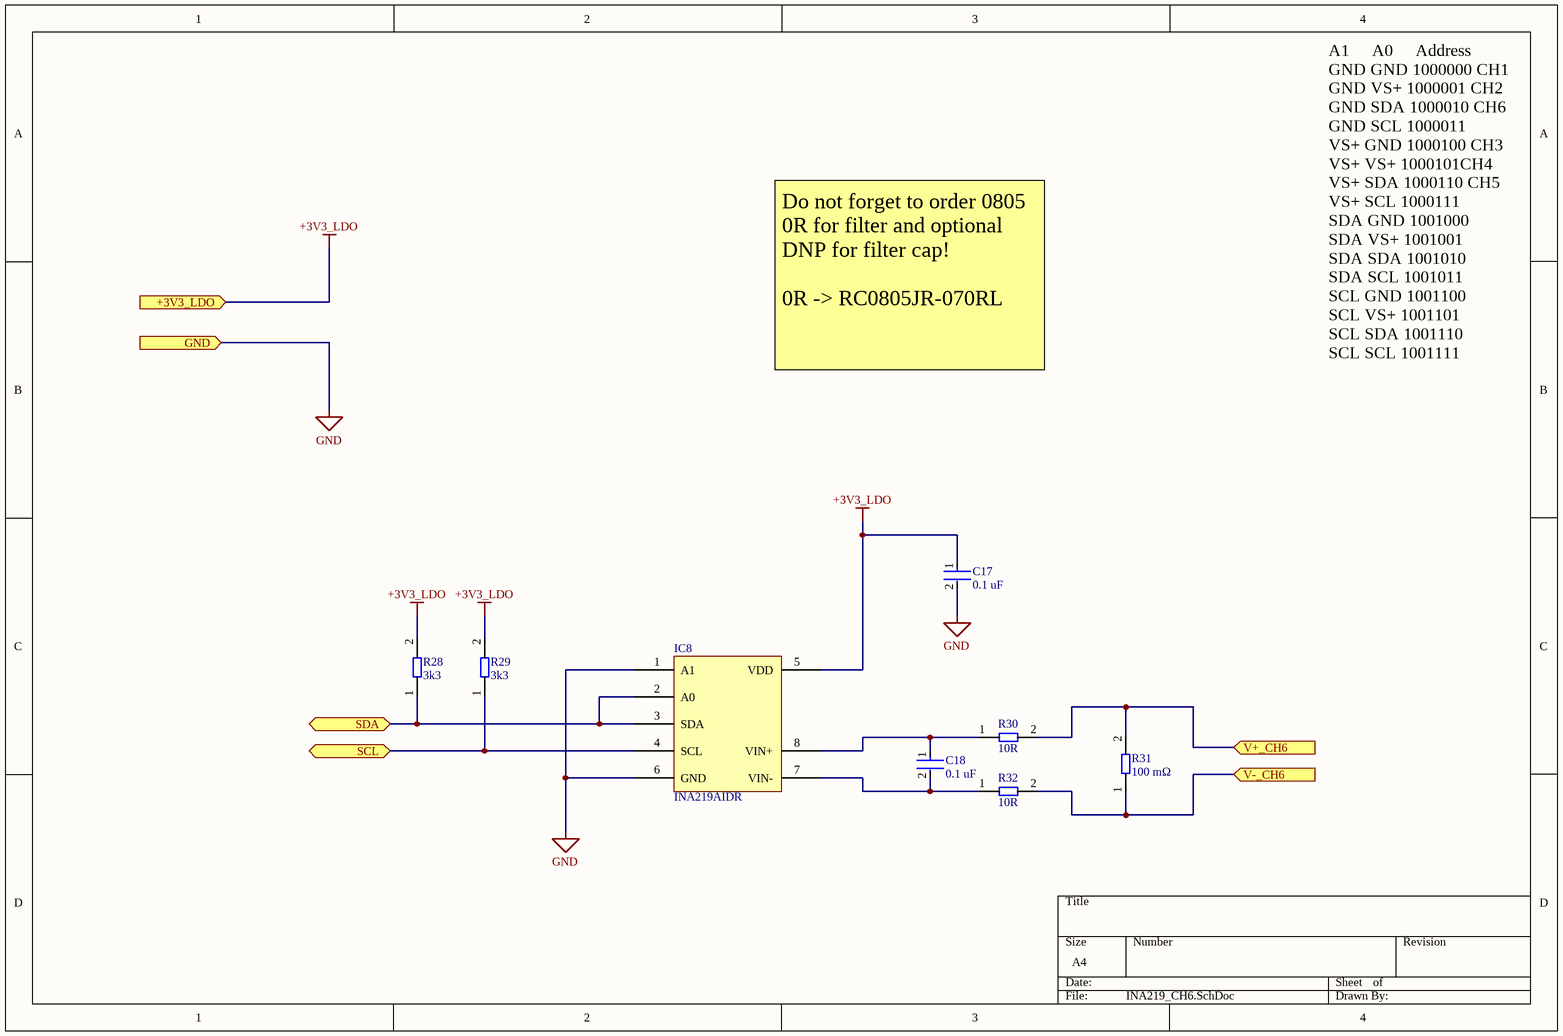
[diagram p7: INA219_CH6.SchDoc]

### Parts
C17  0.1 uF  [FP-C0805C-DN-MFG]
C18  0.1 uF  [FP-C0805C-DN-MFG]
IC8  INA219AIDR  [INA219AIDR]
R28  3k3  [0805 Resistor - IPC A]
R29  3k3  [0805 Resistor - IPC A]
R30  10R  [0805 Resistor - IPC A]
R31  100 mΩ  [PE2512FKM070R1L]
R32  10R  [0805 Resistor - IPC A]

### Ports
+3V3_LDO (in, see Callisto Control Board[7C], 3V3 LDO[3B], BME280[2B], Driver Board[1B], INA219_CH1[1A], INA219_CH2[1B], INA219_CH3[1B], INA219_CH4[1B], INA219_CH5[1B]), GND (in, see Callisto Control Board[7C], 3V3 LDO[3B], BME280[3B], Driver Board[1B], INA219_CH1[1A], INA219_CH2[1B], INA219_CH3[1B], INA219_CH4[1B], INA219_CH5[1B], Raspberry Pi[1C]), SCL (bidir, see Callisto Control Board[7D], BME280[3B], INA219_CH1[1C], INA219_CH2[1C], INA219_CH3[1C], INA219_CH4[1C], INA219_CH5[1C], Raspberry Pi[1B]), SDA (bidir, see Callisto Control Board[7C], BME280[3B], INA219_CH1[1C], INA219_CH2[1C], INA219_CH3[1C], INA219_CH4[1C], INA219_CH5[1C], Raspberry Pi[1A]), V+_CH6 (in), V-_CH6 (in)

### Nets
+3V3_LDO: C17.1 IC8.5(VDD) R28.2 R29.2 ; port +3V3_LDO
GND: C17.2 IC8.1(A1) IC8.6(GND) ; port GND
SCL: IC8.4(SCL) R29.1 ; port SCL
SDA: IC8.2(A0) IC8.3(SDA) R28.1 ; port SDA
NetC18_1: C18.1 IC8.8(VIN+) R30.1
NetC18_2: C18.2 IC8.7(VIN-) R32.1
NetJ2#1_11: R30.2 R31.2 ; port V+_CH6
NetJ2#1_12: R31.1 R32.2 ; port V-_CH6

### Notes on the sheet
- Do not forget to order 0805 0R for filter and optional DNP for filter cap!
  0R -> RC0805JR-070RL
- A1     A0     Address
  GND GND 1000000 CH1
  GND VS+ 1000001 CH2
  GND SDA 1000010 CH6
  GND SCL 1000011
  VS+ GND 1000100 CH3
  VS+ VS+ 1000101CH4
  VS+ SDA 1000110 CH5
  VS+ SCL 1000111
  SDA GND 1001000
  SDA VS+ 1001001
  SDA SDA 1001010
  SDA SCL 1001011
  SCL GND 1001100
  SCL VS+ 1001101
  SCL SDA 1001110
  SCL SCL 1001111

### Library data of the parts
C17 C18 = CMP-03020-002581-2: as C5 on sheet INA219_CH1; Category: Cap; Temperature: -55°C to +125°C; Lead Free: Yes; Device Class L3: Ceramic Capacitors; Package: C0805C-DN; Height: 0.88mm; Temperature Range High: +125°C; Device Class L2: Capacitors; Manufacturer Part Number: C0805C104M5RAC; Device Class L1: Passive Components; Temperature Coefficient: 30ppm/°C; ComponentLink2Description: Datasheet; RoHS: TRUE; Temperature Range Low: -55°C; ComponentLink2URL: https://content.kemet.com/datasheets/KEM_C1003_C0G_SMD.pdf; Temperature Characteristic: X7R; Mouser Description: Multilayer Ceramic Capacitors MLCC - SMD/SMT 50volts 0.1uF 20% X7R; Octopart: https://octopart.com/c0805c104m5rac-kemet-2226142; Ipc Land Pattern Name: CAPC200125X78; Automotive: No
IC8 = INA219AIDR: as IC1 on sheet INA219_CH1
R28 R29 = RE0805FRE073K3L: as R3 on sheet INA219_CH1
R30 R32 = RC0805FR-0710RL: as R5 on sheet INA219_CH1
R31 = PE2512FKM070R1L: as R6 on sheet INA219_CH1

## Sheet Raspberry Pi.SchDoc
size A4; SheetNumber: 10; SheetTotal: 13
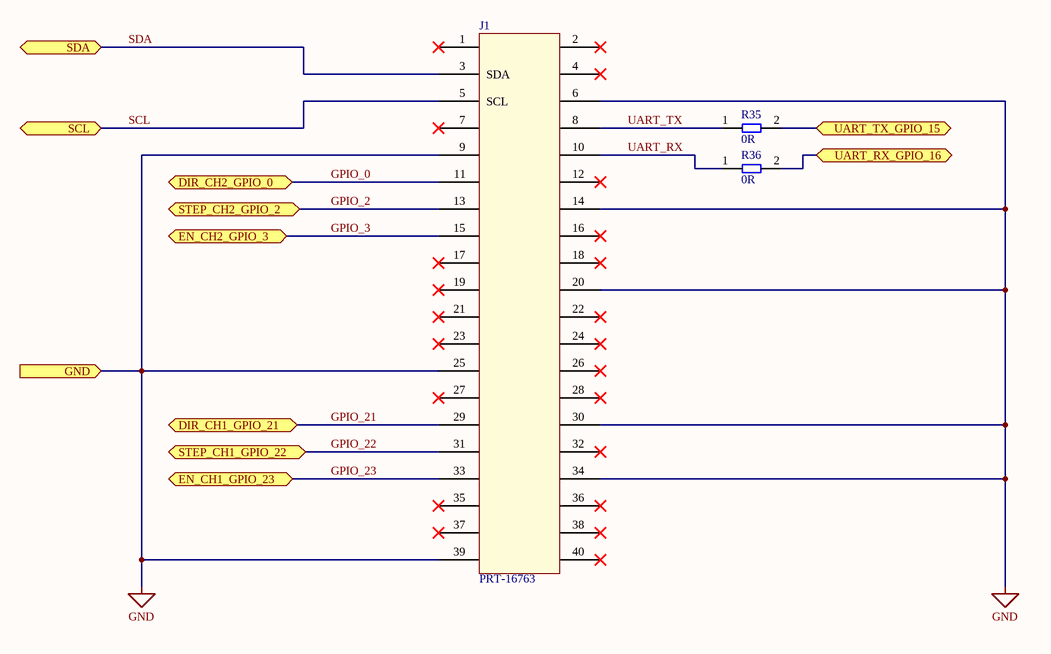
[diagram p8: Raspberry Pi.SchDoc]

### Parts
J1  PRT-16763  [FP-SFH11-PBPC-D20-ST-BK-MFG]
R35  0R  [0805 Resistor - IPC A]
R36  0R  [0805 Resistor - IPC A]

### Ports
DIR_CH1_GPIO_21 (bidir, see Callisto Control Board[3B]), DIR_CH2_GPIO_0 (bidir, see Callisto Control Board[3A]), EN_CH1_GPIO_23 (bidir, see Callisto Control Board[3A]), EN_CH2_GPIO_3 (bidir, see Callisto Control Board[3A]), GND (in, see Callisto Control Board[4A], 3V3 LDO[3B], BME280[3B], Driver Board[1B], INA219_CH1[1A], INA219_CH2[1B], INA219_CH3[1B], INA219_CH4[1B], INA219_CH5[1B], INA219_CH6[1B]), SCL (bidir, see Callisto Control Board[4A], BME280[3B], INA219_CH1[1C], INA219_CH2[1C], INA219_CH3[1C], INA219_CH4[1C], INA219_CH5[1C], INA219_CH6[1C]), SDA (bidir, see Callisto Control Board[4A], BME280[3B], INA219_CH1[1C], INA219_CH2[1C], INA219_CH3[1C], INA219_CH4[1C], INA219_CH5[1C], INA219_CH6[1C]), STEP_CH1_GPIO_22 (bidir, see Callisto Control Board[3A]), STEP_CH2_GPIO_2 (bidir, see Callisto Control Board[3A]), UART_RX_GPIO_16 (bidir, see Callisto Control Board[3B]), UART_TX_GPIO_15 (bidir, see Callisto Control Board[3B])

### Nets
GND: J1.6 J1.9 J1.14 J1.20 J1.25 J1.30 J1.34 J1.39 ; port GND
GPIO_0: J1.11 ; port DIR_CH2_GPIO_0
GPIO_2: J1.13 ; port STEP_CH2_GPIO_2
GPIO_3: J1.15 ; port EN_CH2_GPIO_3
GPIO_21: J1.29 ; port DIR_CH1_GPIO_21
GPIO_22: J1.31 ; port STEP_CH1_GPIO_22
GPIO_23: J1.33 ; port EN_CH1_GPIO_23
SCL: J1.5(SCL) ; port SCL
SDA: J1.3(SDA) ; port SDA
UART_RX: J1.10 R36.1
UART_TX: J1.8 R35.1
NetR35_2: R35.2 ; port UART_TX_GPIO_15
NetR36_2: R36.2 ; port UART_RX_GPIO_16

Not connected (* = marked no-connect by the designer): J1 1* 2* 4* 7* 12* 16* 17* 18* 19* 21* 22* 23* 24* 26* 27* 28* 32* 35* 36* 37* 38* 40*

### Library data of the parts
J1 = Raspberry Pi 3+ Header: Headers & Wire Housings Extended GPIO Female Header - 2x20 Pin (16mm/7.30mm)
R35 R36 = RC0805JR-070RL: Thick Film Resistors - SMD 0 Ohms 125 mW 0805 5% / RC0805JR-070RL

## Sheet BME280.SchDoc
size A4; SheetNumber: 11; SheetTotal: 13
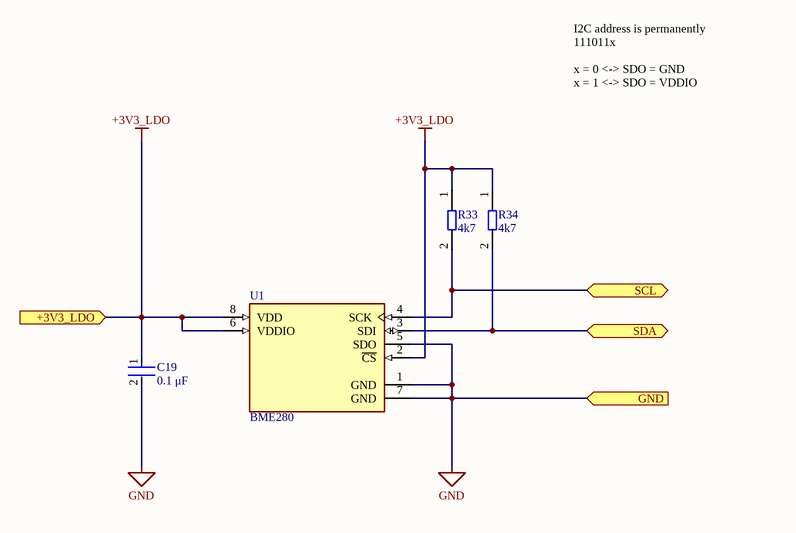
[diagram p9: BME280.SchDoc]

### Parts
C19  0.1 μF  [FP-C0805C-DN-MFG]
R33  4k7  [0805 Resistor - IPC A]
R34  4k7  [0805 Resistor - IPC A]
U1  BME280  [FP-BME280-MFG]

### Ports
+3V3_LDO (in, see Callisto Control Board[7D], 3V3 LDO[3B], Driver Board[1B], INA219_CH1[1A], INA219_CH2[1B], INA219_CH3[1B], INA219_CH4[1B], INA219_CH5[1B], INA219_CH6[1B]), GND (in, see Callisto Control Board[7D], 3V3 LDO[3B], Driver Board[1B], INA219_CH1[1A], INA219_CH2[1B], INA219_CH3[1B], INA219_CH4[1B], INA219_CH5[1B], INA219_CH6[1B], Raspberry Pi[1C]), SCL (bidir, see Callisto Control Board[7D], INA219_CH1[1C], INA219_CH2[1C], INA219_CH3[1C], INA219_CH4[1C], INA219_CH5[1C], INA219_CH6[1C], Raspberry Pi[1B]), SDA (bidir, see Callisto Control Board[7D], INA219_CH1[1C], INA219_CH2[1C], INA219_CH3[1C], INA219_CH4[1C], INA219_CH5[1C], INA219_CH6[1C], Raspberry Pi[1A])

### Nets
+3V3_LDO: C19.1 R33.1 R34.1 U1.2(~{CS}) U1.6(VDDIO) U1.8(VDD) ; port +3V3_LDO
GND: C19.2 U1.1(GND) U1.5(SDO) U1.7(GND) ; port GND
SCL: R33.2 U1.4(SCK) ; port SCL
SDA: R34.2 U1.3(SDI) ; port SDA

### Notes on the sheet
- I2C address is permanently
  111011x
  x = 0 <-> SDO = GND
  x = 1 <-> SDO = VDDIO

### Library data of the parts
C19 = CMP-03020-002581-2: as C7 on sheet 3V3 LDO; Category: Cap; Temperature: -55°C to +125°C; Lead Free: Yes; Device Class L3: Ceramic Capacitors; Package: C0805C-DN; Capacitance: 0.1 μF; Height: 0.88mm; Temperature Range High: +125°C; Device Class L2: Capacitors; Manufacturer Part Number: C0805C104M5RAC; Device Class L1: Passive Components; Temperature Coefficient: 30ppm/°C; ComponentLink2Description: Datasheet; RoHS: TRUE; Temperature Range Low: -55°C; Value: 0.1 μF; ComponentLink2URL: https://content.kemet.com/datasheets/KEM_C1003_C0G_SMD.pdf; Temperature Characteristic: X7R; Mouser Description: Multilayer Ceramic Capacitors MLCC - SMD/SMT 50volts 0.1uF 20% X7R; Octopart: https://octopart.com/c0805c104m5rac-kemet-2226142; Ipc Land Pattern Name: CAPC200125X78; Automotive: No
R33 R34 = RC0805FR-104K7L: Thick Film Resistors - SMD 4.7 kOhms 250 mW 0805 1% / RC0805FR-104K7L; Value: 4k7
U1 = CMP-2000-05073-3: SENSOR PRESSURE HUMIDITY TEMP; Sensor Type: Temperature; Accuracy: 3%; Response Time: 1s; Output Type: SPI; Min Operating Temperature: -40°C; Max Operating Temperature: 85°C; Case/Package: LGA; Packaging: Cut Tape; Mount: Surface Mount; Lead Free: Lead Free; Number of Pins: 8

## Sheet Driver Board.SchDoc
size A3; SheetNumber: 11; SheetTotal: 12
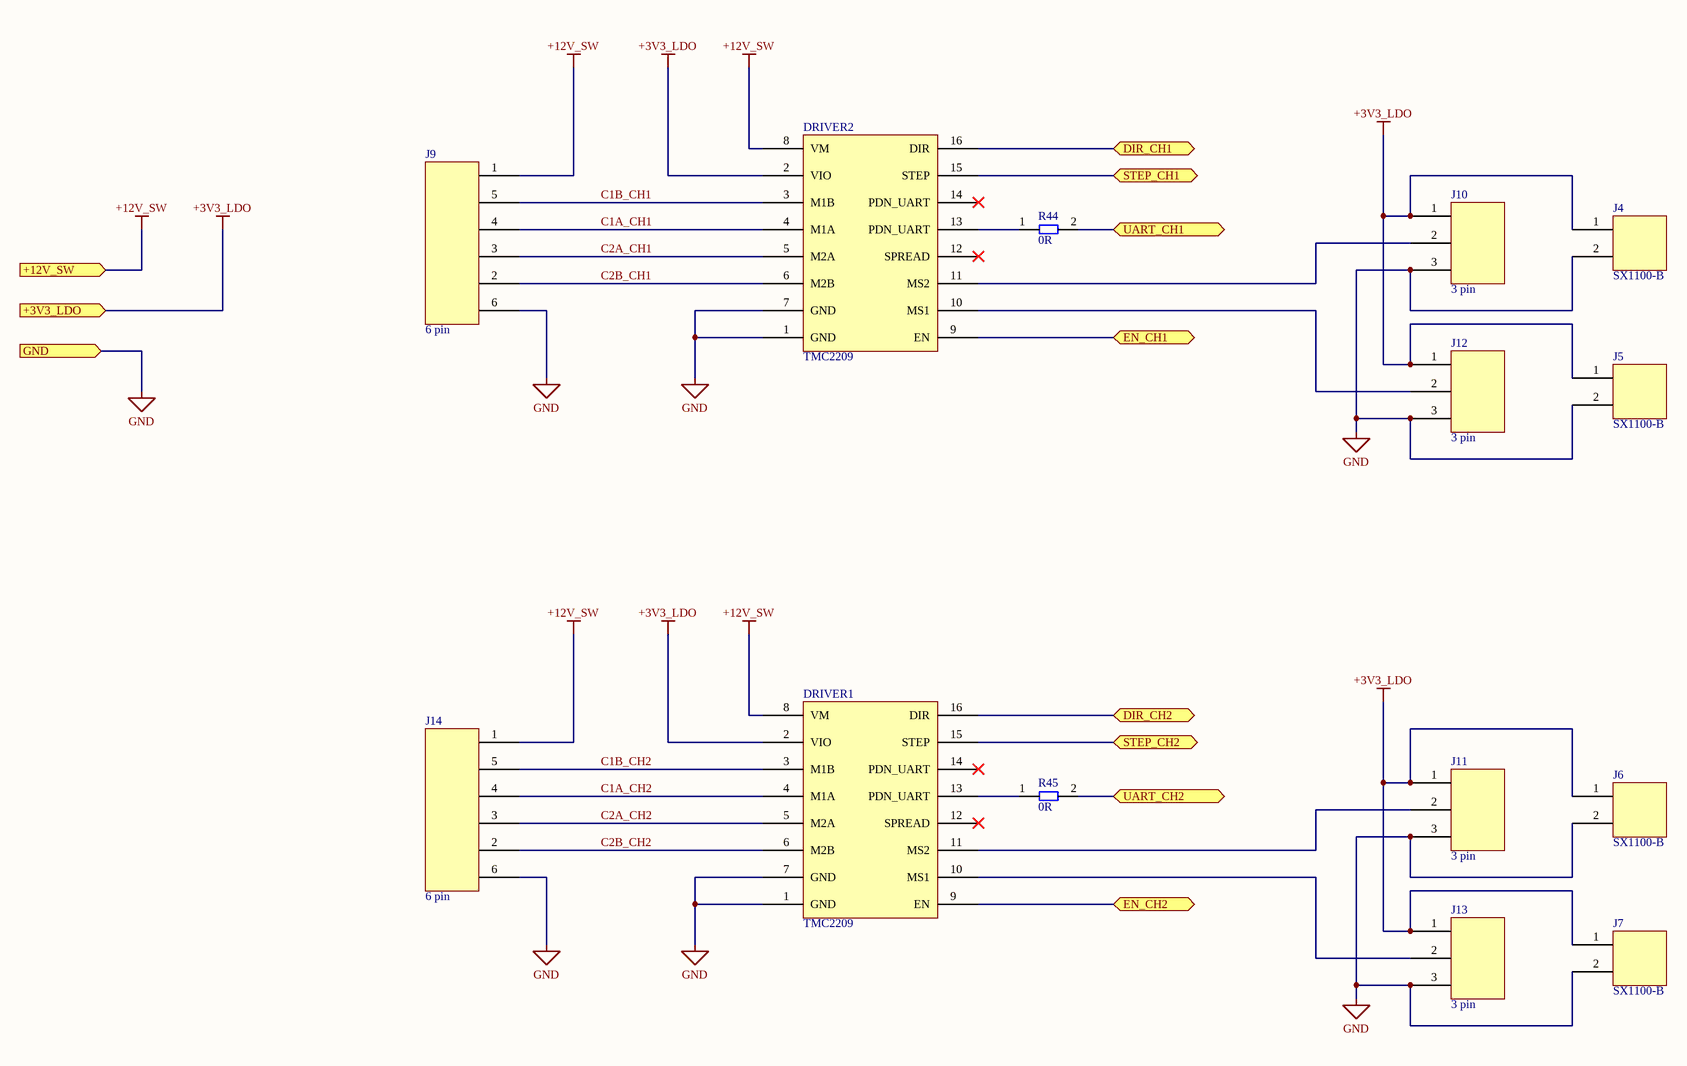
[diagram p10: Driver Board.SchDoc]

### Parts
(Parts that share a designator on the sheet are numbered #1, #2 ... from top to bottom, then left to right.)
DRIVER1  TMC2209  [TMC2209]
DRIVER2  TMC2209  [TMC2209]
J4#2  SX1100-B
J5  SX1100-B
J6  SX1100-B
J7  SX1100-B
J9  6 pin  [6 pin terminal 5 mm]
J10  3 pin  [3 pin header]
J11  3 pin  [3 pin header]
J12  3 pin  [3 pin header]
J13  3 pin  [3 pin header]
J14  6 pin  [6 pin terminal 5 mm]
R44  0R  [0805 Resistor - IPC A]
R45  0R  [0805 Resistor - IPC A]

### Ports
+3V3_LDO (in, see Callisto Control Board[4B], 3V3 LDO[3B], BME280[2B], INA219_CH1[1A], INA219_CH2[1B], INA219_CH3[1B], INA219_CH4[1B], INA219_CH5[1B], INA219_CH6[1B]), +12V_SW (in, see Callisto Control Board[3C], 5V_SMPS[2B]), DIR_CH1 (bidir, see Callisto Control Board[3B]), DIR_CH2 (bidir, see Callisto Control Board[3B]), EN_CH1 (bidir, see Callisto Control Board[3B]), EN_CH2 (bidir, see Callisto Control Board[3B]), GND (in, see Callisto Control Board[3C], 3V3 LDO[3B], BME280[3B], INA219_CH1[1A], INA219_CH2[1B], INA219_CH3[1B], INA219_CH4[1B], INA219_CH5[1B], INA219_CH6[1B], Raspberry Pi[1C]), STEP_CH1 (bidir, see Callisto Control Board[3B]), STEP_CH2 (bidir, see Callisto Control Board[3B]), UART_CH1 (bidir, see Callisto Control Board[3B]), UART_CH2 (bidir, see Callisto Control Board[3B])

### Nets
+3V3_LDO: DRIVER1.2(VIO) DRIVER2.2(VIO) J4#2.1 J5.1 J6.1 J7.1 J10.1 J11.1 J12.1 J13.1 ; port +3V3_LDO
+12V_SW: DRIVER1.8(VM) DRIVER2.8(VM) J9.1 J14.1 ; port +12V_SW
GND: DRIVER1.1(GND) DRIVER1.7(GND) DRIVER2.1(GND) DRIVER2.7(GND) J4#2.2 J5.2 J6.2 J7.2 J9.6 J10.3 J11.3 J12.3 J13.3 J14.6 ; port GND
C1A_CH1: DRIVER2.4(M1A) J9.4
C1A_CH2: DRIVER1.4(M1A) J14.4
C1B_CH1: DRIVER2.3(M1B) J9.5
C1B_CH2: DRIVER1.3(M1B) J14.5
C2A_CH1: DRIVER2.5(M2A) J9.3
C2A_CH2: DRIVER1.5(M2A) J14.3
C2B_CH1: DRIVER2.6(M2B) J9.2
C2B_CH2: DRIVER1.6(M2B) J14.2
GPIO_0: DRIVER1.16(DIR) ; port DIR_CH2
GPIO_2: DRIVER1.15(STEP) ; port STEP_CH2
GPIO_3: DRIVER1.9(EN) ; port EN_CH2
GPIO_21: DRIVER2.16(DIR) ; port DIR_CH1
GPIO_22: DRIVER2.15(STEP) ; port STEP_CH1
GPIO_23: DRIVER2.9(EN) ; port EN_CH1
NetDRIVER1_10: DRIVER1.10(MS1) J13.2
NetDRIVER1_11: DRIVER1.11(MS2) J11.2
NetDRIVER1_13: DRIVER1.13(PDN_UART) R45.1
NetDRIVER2_10: DRIVER2.10(MS1) J12.2
NetDRIVER2_11: DRIVER2.11(MS2) J10.2
NetDRIVER2_13: DRIVER2.13(PDN_UART) R44.1
NetR36_2: R44.2 R45.2 ; port UART_CH2, port UART_CH1

Not connected (* = marked no-connect by the designer): DRIVER1 12(SPREAD)* 14(PDN_UART)*; DRIVER2 12(SPREAD)* 14(PDN_UART)*

### Library data of the parts
DRIVER1 DRIVER2 = TMC2209: TMC2209 FET based stepper motor driver board
J4#2 = Header Jumper: Headers & Wire Housings SHUNT OPEN T BLK / Jumper / SX1100-B
J5-J7 = Header Jumper: Headers & Wire Housings SHUNT OPEN T BLK / SX1100-B
J9 J14 = 6 pin terminal block 5 mm
J10-J13 = 3 pin male header 0.254mm
R44 R45 = RC0805JR-070RL: as R35 on sheet Raspberry Pi

## Nets that join several sheets
+3V3_LDO: INA219_CH1 (C5.1 IC1.5 R3.2 R4.2), 3V3 LDO (C8.1 IC3.2 IC3.4), INA219_CH2 (5 pins), INA219_CH3 (5 pins), INA219_CH4 (6 pins), INA219_CH5 (5 pins), INA219_CH6 (C17.1 IC8.5 R28.2 R29.2), BME280 (6 pins), Driver Board (10 pins)
GND: INA219_CH1 (C5.2 IC1.1 IC1.2 IC1.6), 3V3 LDO (C7.2 C8.2 IC3.1 J3.1), INA219_CH2 (C9.2 IC4.1 IC4.6), INA219_CH3 (C11.2 IC5.2 IC5.6), INA219_CH4 (C13.2 IC6.6), INA219_CH5 (C15.2 IC7.6), INA219_CH6 (C17.2 IC8.1 IC8.6), Raspberry Pi (8 pins), BME280 (C19.2 U1.1 U1.5 U1.7), Driver Board (14 pins)
GPIO_0: Raspberry Pi (J1.11), Driver Board (DRIVER1.16)
GPIO_2: Raspberry Pi (J1.13), Driver Board (DRIVER1.15)
GPIO_3: Raspberry Pi (J1.15), Driver Board (DRIVER1.9)
GPIO_21: Raspberry Pi (J1.29), Driver Board (DRIVER2.16)
GPIO_22: Raspberry Pi (J1.31), Driver Board (DRIVER2.15)
GPIO_23: Raspberry Pi (J1.33), Driver Board (DRIVER2.9)
NetJ2#1_5: Callisto Control Board (J2#1.5), INA219_CH3 (R15.2 R16.2)
NetJ2#1_6: Callisto Control Board (J2#1.6), INA219_CH3 (R16.1 R17.2)
NetJ2#1_7: Callisto Control Board (J2#1.7), INA219_CH4 (R20.2 R21.2)
NetJ2#1_8: Callisto Control Board (J2#1.8), INA219_CH4 (R21.1 R22.2)
NetJ2#1_9: Callisto Control Board (J2#1.9), INA219_CH5 (R25.2 R26.2)
NetJ2#1_10: Callisto Control Board (J2#1.10), INA219_CH5 (R26.1 R27.2)
NetJ2#1_11: Callisto Control Board (J2#1.11), INA219_CH6 (R30.2 R31.2)
NetJ2#1_12: Callisto Control Board (J2#1.12), INA219_CH6 (R31.1 R32.2)
NetR35_2: Callisto Control Board (R37.2), Raspberry Pi (R35.2)
NetR36_2: Callisto Control Board (R37.1), Raspberry Pi (R36.2), Driver Board (R44.2 R45.2)
SCL: INA219_CH1 (IC1.4 R4.1), INA219_CH2 (IC4.4 R9.1), INA219_CH3 (IC5.4 R14.1), INA219_CH4 (IC6.4 R19.1), INA219_CH5 (IC7.4 R24.1), INA219_CH6 (IC8.4 R29.1), Raspberry Pi (J1.5), BME280 (R33.2 U1.4)
SDA: INA219_CH1 (IC1.3 R3.1), INA219_CH2 (IC4.3 R8.1), INA219_CH3 (IC5.3 R13.1), INA219_CH4 (IC6.3 R18.1), INA219_CH5 (IC7.2 IC7.3 R23.1), INA219_CH6 (IC8.2 IC8.3 R28.1), Raspberry Pi (J1.3), BME280 (R34.2 U1.3)